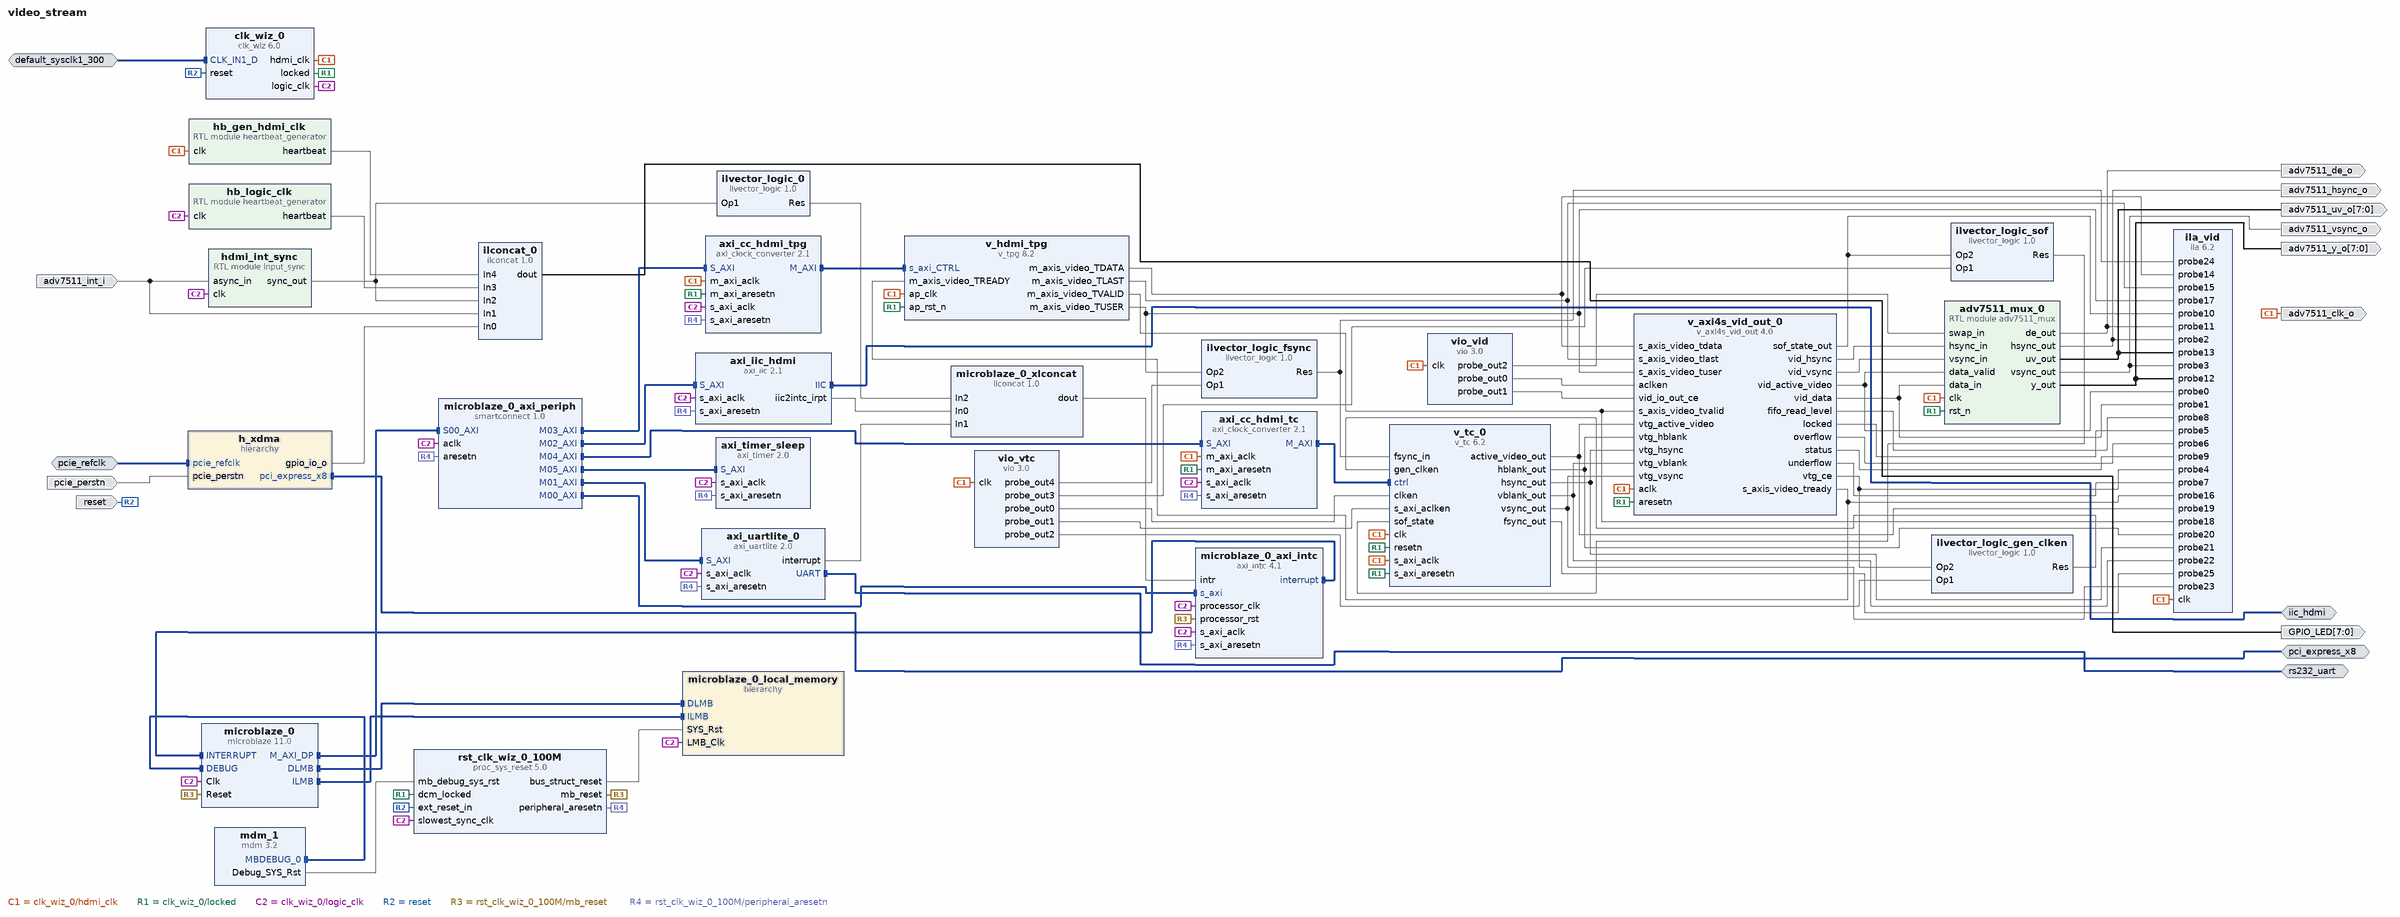
[diagram p0: block diagram of the top level]
# Vivado block design video_stream, xcku5p-ffvb676-2-e, Vivado 2025.2
create_bd_design video_stream

create_bd_intf_port -mode Slave -vlnv xilinx.com:interface:diff_clock_rtl:1.0 pcie_refclk
set_property -dict {CONFIG.FREQ_HZ 100000000} [get_bd_intf_ports pcie_refclk]
create_bd_intf_port -mode Master -vlnv xilinx.com:interface:pcie_7x_mgt_rtl:1.0 pci_express_x8
create_bd_intf_port -mode Slave -vlnv xilinx.com:interface:diff_clock_rtl:1.0 default_sysclk1_300
set_property -dict {CONFIG.FREQ_HZ 300000000} [get_bd_intf_ports default_sysclk1_300]
create_bd_intf_port -mode Master -vlnv xilinx.com:interface:iic_rtl:1.0 iic_hdmi
create_bd_intf_port -mode Master -vlnv xilinx.com:interface:uart_rtl:1.0 rs232_uart
create_bd_port -dir I -type rst pcie_perstn
set_property -dict {CONFIG.POLARITY ACTIVE_LOW} [get_bd_ports pcie_perstn]
create_bd_port -dir I -type rst reset
set_property -dict {CONFIG.POLARITY ACTIVE_HIGH} [get_bd_ports reset]
create_bd_port -dir O -from 7 -to 0 adv7511_y_o
create_bd_port -dir O -from 7 -to 0 adv7511_uv_o
create_bd_port -dir O adv7511_de_o
create_bd_port -dir O adv7511_hsync_o
create_bd_port -dir O adv7511_vsync_o
create_bd_port -dir O adv7511_clk_o
create_bd_port -dir O -from 7 -to 0 GPIO_LED
create_bd_port -dir I adv7511_int_i

create_bd_cell -type ip -vlnv xilinx.com:ip:v_tpg:8.2 v_hdmi_tpg
set_property -dict [list \
  CONFIG.COLOR_SWEEP 1 \
  CONFIG.DISPLAY_PORT 0 \
  CONFIG.HAS_AXI4S_SLAVE 0 \
  CONFIG.HAS_AXI4_YUV422_YUV420 1 \
  CONFIG.MAX_COLS 1920 \
  CONFIG.MAX_ROWS 1080 \
  CONFIG.RAMP 1 \
  CONFIG.ZONE_PLATE 1 \
] [get_bd_cells v_hdmi_tpg]
create_bd_cell -type ip -vlnv xilinx.com:ip:clk_wiz:6.0 clk_wiz_0
set_property -dict [list \
  CONFIG.CLKIN1_JITTER_PS 33.330000000000005 \
  CONFIG.CLKOUT1_JITTER 115.350 \
  CONFIG.CLKOUT1_PHASE_ERROR 87.466 \
  CONFIG.CLKOUT1_REQUESTED_OUT_FREQ 100 \
  CONFIG.CLKOUT2_JITTER 107.131 \
  CONFIG.CLKOUT2_PHASE_ERROR 87.466 \
  CONFIG.CLKOUT2_REQUESTED_OUT_FREQ 148.4375 \
  CONFIG.CLKOUT2_USED true \
  CONFIG.CLK_IN1_BOARD_INTERFACE default_sysclk1_300 \
  CONFIG.CLK_OUT1_PORT logic_clk \
  CONFIG.CLK_OUT2_PORT hdmi_clk \
  CONFIG.MMCM_CLKFBOUT_MULT_F 11.875 \
  CONFIG.MMCM_CLKIN1_PERIOD 3.333 \
  CONFIG.MMCM_CLKIN2_PERIOD 10.0 \
  CONFIG.MMCM_CLKOUT0_DIVIDE_F 11.875 \
  CONFIG.MMCM_CLKOUT1_DIVIDE 8 \
  CONFIG.MMCM_DIVCLK_DIVIDE 3 \
  CONFIG.NUM_OUT_CLKS 2 \
  CONFIG.PRIM_SOURCE Differential_clock_capable_pin \
  CONFIG.RESET_BOARD_INTERFACE reset \
  CONFIG.RESET_PORT reset \
  CONFIG.RESET_TYPE ACTIVE_HIGH \
  CONFIG.USE_BOARD_FLOW true \
] [get_bd_cells clk_wiz_0]
create_bd_cell -type ip -vlnv xilinx.com:ip:axi_iic:2.1 axi_iic_hdmi
set_property -dict {CONFIG.IIC_BOARD_INTERFACE Custom CONFIG.USE_BOARD_FLOW true} [get_bd_cells axi_iic_hdmi]
create_bd_cell -type ip -vlnv xilinx.com:ip:microblaze:11.0 microblaze_0
set_property -dict [list \
  CONFIG.C_DEBUG_ENABLED 1 \
  CONFIG.C_D_AXI 1 \
  CONFIG.C_D_LMB 1 \
  CONFIG.C_ENABLE_CONVERSION 0 \
  CONFIG.C_I_LMB 1 \
] [get_bd_cells microblaze_0]
create_bd_cell -type hier microblaze_0_local_memory
create_bd_cell -type ip -vlnv xilinx.com:ip:smartconnect:1.0 microblaze_0_axi_periph
set_property -dict {CONFIG.NUM_MI 6 CONFIG.NUM_SI 1} [get_bd_cells microblaze_0_axi_periph]
create_bd_cell -type ip -vlnv xilinx.com:ip:axi_intc:4.1 microblaze_0_axi_intc
set_property -dict [list \
  CONFIG.C_HAS_FAST 1 \
  CONFIG.C_KIND_OF_EDGE 0xFFFFFFFF \
  CONFIG.C_KIND_OF_INTR 0xFFFFFFF8 \
  CONFIG.C_KIND_OF_LVL 0xFFFFFFFF \
] [get_bd_cells microblaze_0_axi_intc]
create_bd_cell -type inline_hdl -vlnv xilinx.com:inline_hdl:ilconcat:1.0 microblaze_0_xlconcat
set_property -dict {CONFIG.NUM_PORTS 3} [get_bd_cells microblaze_0_xlconcat]
create_bd_cell -type ip -vlnv xilinx.com:ip:mdm:3.2 mdm_1
create_bd_cell -type ip -vlnv xilinx.com:ip:proc_sys_reset:5.0 rst_clk_wiz_0_100M
set_property -dict {CONFIG.RESET_BOARD_INTERFACE reset CONFIG.USE_BOARD_FLOW true} [get_bd_cells rst_clk_wiz_0_100M]
create_bd_cell -type ip -vlnv xilinx.com:ip:axi_uartlite:2.0 axi_uartlite_0
set_property -dict {CONFIG.UARTLITE_BOARD_INTERFACE rs232_uart CONFIG.USE_BOARD_FLOW true} [get_bd_cells axi_uartlite_0]
create_bd_cell -type hier h_xdma
create_bd_cell -type ip -vlnv xilinx.com:ip:v_tc:6.2 v_tc_0
set_property -dict [list \
  CONFIG.INTERLACE_EN false \
  CONFIG.SYNC_EN true \
  CONFIG.VIDEO_MODE 1080p \
  CONFIG.enable_detection false \
  CONFIG.enable_generation true \
] [get_bd_cells v_tc_0]
create_bd_cell -type ip -vlnv xilinx.com:ip:axi_clock_converter:2.1 axi_cc_hdmi_tc
create_bd_cell -type ip -vlnv xilinx.com:ip:v_axi4s_vid_out:4.0 v_axi4s_vid_out_0
set_property -dict {CONFIG.C_ADDR_WIDTH 11 CONFIG.C_S_AXIS_VIDEO_FORMAT 2} [get_bd_cells v_axi4s_vid_out_0]
create_bd_cell -type ip -vlnv xilinx.com:ip:axi_clock_converter:2.1 axi_cc_hdmi_tpg
create_bd_cell -type module -reference adv7511_mux adv7511_mux_0
create_bd_cell -type inline_hdl -vlnv xilinx.com:inline_hdl:ilvector_logic:1.0 ilvector_logic_0
set_property -dict {CONFIG.C_OPERATION not CONFIG.C_SIZE 1} [get_bd_cells ilvector_logic_0]
create_bd_cell -type module -reference input_sync hdmi_int_sync
create_bd_cell -type inline_hdl -vlnv xilinx.com:inline_hdl:ilconcat:1.0 ilconcat_0
set_property -dict {CONFIG.NUM_PORTS 5} [get_bd_cells ilconcat_0]
create_bd_cell -type module -reference heartbeat_generator hb_logic_clk
create_bd_cell -type module -reference heartbeat_generator hb_gen_hdmi_clk
create_bd_cell -type ip -vlnv xilinx.com:ip:axi_timer:2.0 axi_timer_sleep
create_bd_cell -type ip -vlnv xilinx.com:ip:vio:3.0 vio_vtc
set_property -dict [list \
  CONFIG.C_NUM_PROBE_IN 0 \
  CONFIG.C_NUM_PROBE_OUT 5 \
  CONFIG.C_PROBE_OUT0_INIT_VAL 0x1 \
  CONFIG.C_PROBE_OUT1_INIT_VAL 0x1 \
  CONFIG.C_PROBE_OUT2_INIT_VAL 0x1 \
  CONFIG.C_PROBE_OUT3_INIT_VAL 0x1 \
  CONFIG.C_PROBE_OUT4_INIT_VAL 0x0 \
] [get_bd_cells vio_vtc]
create_bd_cell -type ip -vlnv xilinx.com:ip:ila:6.2 ila_vid
set_property -dict {CONFIG.C_DATA_DEPTH 4096 CONFIG.C_MONITOR_TYPE Native CONFIG.C_NUM_OF_PROBES 26} [get_bd_cells ila_vid]
create_bd_cell -type ip -vlnv xilinx.com:ip:vio:3.0 vio_vid
set_property -dict [list \
  CONFIG.C_NUM_PROBE_IN 0 \
  CONFIG.C_NUM_PROBE_OUT 3 \
  CONFIG.C_PROBE_OUT0_INIT_VAL 0x1 \
  CONFIG.C_PROBE_OUT1_INIT_VAL 0x1 \
] [get_bd_cells vio_vid]
create_bd_cell -type inline_hdl -vlnv xilinx.com:inline_hdl:ilvector_logic:1.0 ilvector_logic_gen_clken
set_property -dict {CONFIG.C_SIZE 1} [get_bd_cells ilvector_logic_gen_clken]
create_bd_cell -type inline_hdl -vlnv xilinx.com:inline_hdl:ilvector_logic:1.0 ilvector_logic_sof
set_property -dict {CONFIG.C_SIZE 1} [get_bd_cells ilvector_logic_sof]
create_bd_cell -type inline_hdl -vlnv xilinx.com:inline_hdl:ilvector_logic:1.0 ilvector_logic_fsync
set_property -dict {CONFIG.C_SIZE 1} [get_bd_cells ilvector_logic_fsync]

# ---- hierarchy /microblaze_0_local_memory ----
current_bd_instance /microblaze_0_local_memory
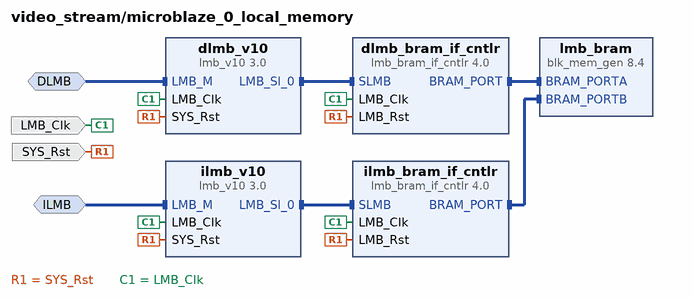
[diagram p1: block diagram inside /microblaze_0_local_memory]
create_bd_intf_pin -mode MirroredMaster -vlnv xilinx.com:interface:lmb_rtl:1.0 DLMB
create_bd_intf_pin -mode MirroredMaster -vlnv xilinx.com:interface:lmb_rtl:1.0 ILMB
create_bd_pin -dir I -type clk LMB_Clk
create_bd_pin -dir I -type rst SYS_Rst

create_bd_cell -type ip -vlnv xilinx.com:ip:lmb_v10:3.0 dlmb_v10
create_bd_cell -type ip -vlnv xilinx.com:ip:lmb_v10:3.0 ilmb_v10
create_bd_cell -type ip -vlnv xilinx.com:ip:lmb_bram_if_cntlr:4.0 dlmb_bram_if_cntlr
set_property -dict {CONFIG.C_ECC 0} [get_bd_cells dlmb_bram_if_cntlr]
create_bd_cell -type ip -vlnv xilinx.com:ip:lmb_bram_if_cntlr:4.0 ilmb_bram_if_cntlr
set_property -dict {CONFIG.C_ECC 0} [get_bd_cells ilmb_bram_if_cntlr]
create_bd_cell -type ip -vlnv xilinx.com:ip:blk_mem_gen:8.4 lmb_bram
set_property -dict {CONFIG.Memory_Type True_Dual_Port_RAM CONFIG.use_bram_block BRAM_Controller} [get_bd_cells lmb_bram]

# ---- hierarchy /h_xdma ----
current_bd_instance /h_xdma
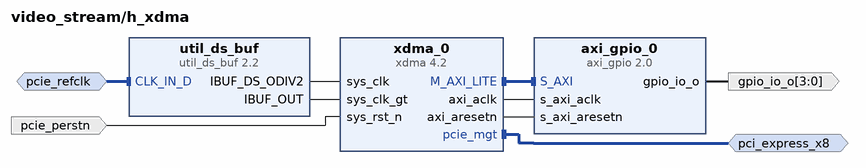
[diagram p2: block diagram inside /h_xdma]
create_bd_intf_pin -mode Master -vlnv xilinx.com:interface:pcie_7x_mgt_rtl:1.0 pci_express_x8
create_bd_intf_pin -mode Slave -vlnv xilinx.com:interface:diff_clock_rtl:1.0 pcie_refclk
create_bd_pin -dir I -type rst pcie_perstn
create_bd_pin -dir O -from 3 -to 0 gpio_io_o

create_bd_cell -type ip -vlnv xilinx.com:ip:xdma:4.2 xdma_0
set_property -dict [list \
  CONFIG.PCIE_BOARD_INTERFACE pci_express_x8 \
  CONFIG.SYS_RST_N_BOARD_INTERFACE pcie_perstn \
  CONFIG.axi_data_width 256_bit \
  CONFIG.axilite_master_en true \
  CONFIG.axilite_master_size 1 \
  CONFIG.axisten_freq 250 \
  CONFIG.pl_link_cap_max_link_speed 8.0_GT/s \
  CONFIG.xdma_axi_intf_mm AXI_Stream \
  CONFIG.xdma_axilite_slave false \
  CONFIG.xdma_rnum_chnl 1 \
] [get_bd_cells xdma_0]
create_bd_cell -type ip -vlnv xilinx.com:ip:util_ds_buf:2.2 util_ds_buf
set_property -dict {CONFIG.DIFF_CLK_IN_BOARD_INTERFACE pcie_refclk CONFIG.USE_BOARD_FLOW true} [get_bd_cells util_ds_buf]
create_bd_cell -type ip -vlnv xilinx.com:ip:axi_gpio:2.0 axi_gpio_0
set_property -dict {CONFIG.C_GPIO_WIDTH 4 CONFIG.GPIO_BOARD_INTERFACE Custom CONFIG.USE_BOARD_FLOW true} [get_bd_cells axi_gpio_0]

# ---- connections ----

current_bd_instance /microblaze_0_local_memory
connect_bd_intf_net -intf_net microblaze_0_dlmb [get_bd_intf_pins dlmb_v10/LMB_M] [get_bd_intf_pins DLMB]
connect_bd_intf_net -intf_net microblaze_0_dlmb_bus [get_bd_intf_pins dlmb_v10/LMB_Sl_0] [get_bd_intf_pins dlmb_bram_if_cntlr/SLMB]
connect_bd_intf_net -intf_net microblaze_0_dlmb_cntlr [get_bd_intf_pins dlmb_bram_if_cntlr/BRAM_PORT] [get_bd_intf_pins lmb_bram/BRAM_PORTA]
connect_bd_intf_net -intf_net microblaze_0_ilmb [get_bd_intf_pins ilmb_v10/LMB_M] [get_bd_intf_pins ILMB]
connect_bd_intf_net -intf_net microblaze_0_ilmb_bus [get_bd_intf_pins ilmb_v10/LMB_Sl_0] [get_bd_intf_pins ilmb_bram_if_cntlr/SLMB]
connect_bd_intf_net -intf_net microblaze_0_ilmb_cntlr [get_bd_intf_pins ilmb_bram_if_cntlr/BRAM_PORT] [get_bd_intf_pins lmb_bram/BRAM_PORTB]
connect_bd_net [get_bd_pins SYS_Rst] \
  [get_bd_pins dlmb_v10/SYS_Rst] [get_bd_pins dlmb_bram_if_cntlr/LMB_Rst] [get_bd_pins ilmb_v10/SYS_Rst] \
  [get_bd_pins ilmb_bram_if_cntlr/LMB_Rst]
connect_bd_net -net clk_wiz_0_logic_clk [get_bd_pins LMB_Clk] \
  [get_bd_pins dlmb_v10/LMB_Clk] [get_bd_pins dlmb_bram_if_cntlr/LMB_Clk] [get_bd_pins ilmb_v10/LMB_Clk] \
  [get_bd_pins ilmb_bram_if_cntlr/LMB_Clk]
set_property HDL_ATTRIBUTE.BMM_INFO_ADDRESS_SPACE {byte  0x00000000 32 > video_stream microblaze_0_local_memory/lmb_bram} [get_bd_cells dlmb_bram_if_cntlr]
set_property HDL_ATTRIBUTE.KEEP_HIERARCHY yes [get_bd_cells dlmb_bram_if_cntlr]

current_bd_instance /h_xdma
connect_bd_intf_net [get_bd_intf_pins pcie_refclk] [get_bd_intf_pins util_ds_buf/CLK_IN_D]
connect_bd_intf_net [get_bd_intf_pins axi_gpio_0/S_AXI] [get_bd_intf_pins xdma_0/M_AXI_LITE]
connect_bd_intf_net [get_bd_intf_pins pci_express_x8] [get_bd_intf_pins xdma_0/pcie_mgt]
connect_bd_net [get_bd_pins axi_gpio_0/gpio_io_o] [get_bd_pins gpio_io_o]
connect_bd_net [get_bd_pins pcie_perstn] [get_bd_pins xdma_0/sys_rst_n]
connect_bd_net [get_bd_pins util_ds_buf/IBUF_DS_ODIV2] [get_bd_pins xdma_0/sys_clk]
connect_bd_net [get_bd_pins util_ds_buf/IBUF_OUT] [get_bd_pins xdma_0/sys_clk_gt]
connect_bd_net [get_bd_pins xdma_0/axi_aclk] [get_bd_pins axi_gpio_0/s_axi_aclk]
connect_bd_net [get_bd_pins xdma_0/axi_aresetn] [get_bd_pins axi_gpio_0/s_axi_aresetn]

current_bd_instance /
connect_bd_intf_net -intf_net axi_clock_converter_0_M_AXI [get_bd_intf_pins axi_cc_hdmi_tc/M_AXI] [get_bd_intf_pins v_tc_0/ctrl]
connect_bd_intf_net -intf_net axi_clock_converter_1_M_AXI [get_bd_intf_pins axi_cc_hdmi_tpg/M_AXI] [get_bd_intf_pins v_hdmi_tpg/s_axi_CTRL]
connect_bd_intf_net -intf_net axi_iic_0_IIC [get_bd_intf_ports iic_hdmi] [get_bd_intf_pins axi_iic_hdmi/IIC]
connect_bd_intf_net [get_bd_intf_ports rs232_uart] [get_bd_intf_pins axi_uartlite_0/UART]
connect_bd_intf_net -intf_net default_sysclk1_300_1 [get_bd_intf_ports default_sysclk1_300] [get_bd_intf_pins clk_wiz_0/CLK_IN1_D]
connect_bd_intf_net -intf_net microblaze_0_axi_dp [get_bd_intf_pins microblaze_0_axi_periph/S00_AXI] [get_bd_intf_pins microblaze_0/M_AXI_DP]
connect_bd_intf_net [get_bd_intf_pins microblaze_0_axi_periph/M00_AXI] [get_bd_intf_pins microblaze_0_axi_intc/s_axi]
connect_bd_intf_net [get_bd_intf_pins axi_uartlite_0/S_AXI] [get_bd_intf_pins microblaze_0_axi_periph/M01_AXI]
connect_bd_intf_net [get_bd_intf_pins axi_iic_hdmi/S_AXI] [get_bd_intf_pins microblaze_0_axi_periph/M02_AXI]
connect_bd_intf_net [get_bd_intf_pins microblaze_0_axi_periph/M03_AXI] [get_bd_intf_pins axi_cc_hdmi_tpg/S_AXI]
connect_bd_intf_net [get_bd_intf_pins axi_cc_hdmi_tc/S_AXI] [get_bd_intf_pins microblaze_0_axi_periph/M04_AXI]
connect_bd_intf_net [get_bd_intf_pins microblaze_0_axi_periph/M05_AXI] [get_bd_intf_pins axi_timer_sleep/S_AXI]
connect_bd_intf_net [get_bd_intf_pins mdm_1/MBDEBUG_0] [get_bd_intf_pins microblaze_0/DEBUG]
connect_bd_intf_net [get_bd_intf_pins microblaze_0/DLMB] [get_bd_intf_pins microblaze_0_local_memory/DLMB]
connect_bd_intf_net [get_bd_intf_pins microblaze_0/ILMB] [get_bd_intf_pins microblaze_0_local_memory/ILMB]
connect_bd_intf_net [get_bd_intf_pins microblaze_0_axi_intc/interrupt] [get_bd_intf_pins microblaze_0/INTERRUPT]
connect_bd_intf_net [get_bd_intf_ports pcie_refclk] [get_bd_intf_pins h_xdma/pcie_refclk]
connect_bd_intf_net -intf_net xdma_0_pcie_mgt [get_bd_intf_ports pci_express_x8] [get_bd_intf_pins h_xdma/pci_express_x8]
connect_bd_net [get_bd_ports adv7511_int_i] [get_bd_pins hdmi_int_sync/async_in] [get_bd_pins ilconcat_0/In1]
connect_bd_net [get_bd_pins adv7511_mux_0/de_out] [get_bd_ports adv7511_de_o] [get_bd_pins ila_vid/probe11]
connect_bd_net [get_bd_pins adv7511_mux_0/hsync_out] [get_bd_ports adv7511_hsync_o] [get_bd_pins ila_vid/probe2]
connect_bd_net [get_bd_pins adv7511_mux_0/uv_out] [get_bd_ports adv7511_uv_o] [get_bd_pins ila_vid/probe13]
connect_bd_net [get_bd_pins adv7511_mux_0/vsync_out] [get_bd_ports adv7511_vsync_o] [get_bd_pins ila_vid/probe3]
connect_bd_net [get_bd_pins adv7511_mux_0/y_out] [get_bd_ports adv7511_y_o] [get_bd_pins ila_vid/probe12]
connect_bd_net -net axi_iic_0_iic2intc_irpt [get_bd_pins axi_iic_hdmi/iic2intc_irpt] [get_bd_pins microblaze_0_xlconcat/In0]
connect_bd_net [get_bd_pins axi_uartlite_0/interrupt] [get_bd_pins microblaze_0_xlconcat/In1]
connect_bd_net -net clk_wiz_0_clk_out1 [get_bd_pins clk_wiz_0/hdmi_clk] \
  [get_bd_pins axi_cc_hdmi_tc/m_axi_aclk] [get_bd_pins v_tc_0/clk] [get_bd_pins axi_cc_hdmi_tpg/m_axi_aclk] \
  [get_bd_pins v_hdmi_tpg/ap_clk] [get_bd_pins v_axi4s_vid_out_0/aclk] [get_bd_pins v_tc_0/s_axi_aclk] \
  [get_bd_ports adv7511_clk_o] [get_bd_pins hb_gen_hdmi_clk/clk] [get_bd_pins vio_vtc/clk] [get_bd_pins ila_vid/clk] \
  [get_bd_pins vio_vid/clk] [get_bd_pins adv7511_mux_0/clk]
connect_bd_net [get_bd_pins clk_wiz_0/locked] \
  [get_bd_pins rst_clk_wiz_0_100M/dcm_locked] [get_bd_pins axi_cc_hdmi_tc/m_axi_aresetn] [get_bd_pins v_tc_0/s_axi_aresetn] \
  [get_bd_pins axi_cc_hdmi_tpg/m_axi_aresetn] [get_bd_pins v_hdmi_tpg/ap_rst_n] [get_bd_pins v_axi4s_vid_out_0/aresetn] \
  [get_bd_pins v_tc_0/resetn] [get_bd_pins adv7511_mux_0/rst_n]
connect_bd_net [get_bd_pins clk_wiz_0/logic_clk] \
  [get_bd_pins microblaze_0/Clk] [get_bd_pins microblaze_0_axi_periph/aclk] [get_bd_pins microblaze_0_axi_intc/s_axi_aclk] \
  [get_bd_pins microblaze_0_axi_intc/processor_clk] [get_bd_pins microblaze_0_local_memory/LMB_Clk] \
  [get_bd_pins rst_clk_wiz_0_100M/slowest_sync_clk] [get_bd_pins axi_uartlite_0/s_axi_aclk] \
  [get_bd_pins axi_iic_hdmi/s_axi_aclk] [get_bd_pins axi_cc_hdmi_tc/s_axi_aclk] [get_bd_pins axi_cc_hdmi_tpg/s_axi_aclk] \
  [get_bd_pins hdmi_int_sync/clk] [get_bd_pins hb_logic_clk/clk] [get_bd_pins axi_timer_sleep/s_axi_aclk]
connect_bd_net [get_bd_pins h_xdma/gpio_io_o] [get_bd_pins ilconcat_0/In0]
connect_bd_net [get_bd_pins hb_gen_hdmi_clk/heartbeat] [get_bd_pins ilconcat_0/In4]
connect_bd_net [get_bd_pins hb_logic_clk/heartbeat] [get_bd_pins ilconcat_0/In3]
connect_bd_net [get_bd_pins ilconcat_0/dout] [get_bd_ports GPIO_LED]
connect_bd_net [get_bd_pins ilvector_logic_0/Res] [get_bd_pins microblaze_0_xlconcat/In2]
connect_bd_net [get_bd_pins ilvector_logic_fsync/Res] [get_bd_pins v_tc_0/fsync_in] [get_bd_pins ila_vid/probe24]
connect_bd_net [get_bd_pins ilvector_logic_gen_clken/Res] [get_bd_pins v_tc_0/gen_clken]
connect_bd_net [get_bd_pins ilvector_logic_sof/Res] [get_bd_pins v_tc_0/sof_state]
connect_bd_net -net input_sync_0_sync_out [get_bd_pins hdmi_int_sync/sync_out] [get_bd_pins ilvector_logic_0/Op1] [get_bd_pins ilconcat_0/In2]
connect_bd_net [get_bd_pins mdm_1/Debug_SYS_Rst] [get_bd_pins rst_clk_wiz_0_100M/mb_debug_sys_rst]
connect_bd_net -net microblaze_0_intr [get_bd_pins microblaze_0_xlconcat/dout] [get_bd_pins microblaze_0_axi_intc/intr]
connect_bd_net [get_bd_ports pcie_perstn] [get_bd_pins h_xdma/pcie_perstn]
connect_bd_net [get_bd_ports reset] [get_bd_pins rst_clk_wiz_0_100M/ext_reset_in] [get_bd_pins clk_wiz_0/reset]
connect_bd_net [get_bd_pins rst_clk_wiz_0_100M/bus_struct_reset] [get_bd_pins microblaze_0_local_memory/SYS_Rst]
connect_bd_net [get_bd_pins rst_clk_wiz_0_100M/mb_reset] [get_bd_pins microblaze_0/Reset] [get_bd_pins microblaze_0_axi_intc/processor_rst]
connect_bd_net [get_bd_pins rst_clk_wiz_0_100M/peripheral_aresetn] \
  [get_bd_pins microblaze_0_axi_periph/aresetn] [get_bd_pins microblaze_0_axi_intc/s_axi_aresetn] \
  [get_bd_pins axi_uartlite_0/s_axi_aresetn] [get_bd_pins axi_iic_hdmi/s_axi_aresetn] \
  [get_bd_pins axi_cc_hdmi_tc/s_axi_aresetn] [get_bd_pins axi_cc_hdmi_tpg/s_axi_aresetn] \
  [get_bd_pins axi_timer_sleep/s_axi_aresetn]
connect_bd_net [get_bd_pins v_axi4s_vid_out_0/fifo_read_level] [get_bd_pins ila_vid/probe8]
connect_bd_net [get_bd_pins v_axi4s_vid_out_0/locked] [get_bd_pins ila_vid/probe5]
connect_bd_net [get_bd_pins v_axi4s_vid_out_0/overflow] [get_bd_pins ila_vid/probe6]
connect_bd_net [get_bd_pins v_axi4s_vid_out_0/s_axis_video_tready] [get_bd_pins v_hdmi_tpg/m_axis_video_TREADY] [get_bd_pins ila_vid/probe16]
connect_bd_net [get_bd_pins v_axi4s_vid_out_0/sof_state_out] [get_bd_pins ila_vid/probe10] [get_bd_pins ilvector_logic_sof/Op2]
connect_bd_net [get_bd_pins v_axi4s_vid_out_0/status] [get_bd_pins ila_vid/probe9]
connect_bd_net [get_bd_pins v_axi4s_vid_out_0/underflow] [get_bd_pins ila_vid/probe7]
connect_bd_net [get_bd_pins v_axi4s_vid_out_0/vid_active_video] [get_bd_pins ila_vid/probe0] [get_bd_pins adv7511_mux_0/data_valid]
connect_bd_net [get_bd_pins v_axi4s_vid_out_0/vid_data] [get_bd_pins ila_vid/probe1] [get_bd_pins adv7511_mux_0/data_in]
connect_bd_net [get_bd_pins v_axi4s_vid_out_0/vid_hsync] [get_bd_pins adv7511_mux_0/hsync_in]
connect_bd_net [get_bd_pins v_axi4s_vid_out_0/vid_vsync] [get_bd_pins adv7511_mux_0/vsync_in]
connect_bd_net [get_bd_pins v_axi4s_vid_out_0/vtg_ce] [get_bd_pins ila_vid/probe4] [get_bd_pins ilvector_logic_gen_clken/Op2]
connect_bd_net [get_bd_pins v_hdmi_tpg/m_axis_video_TDATA] [get_bd_pins v_axi4s_vid_out_0/s_axis_video_tdata] [get_bd_pins ila_vid/probe14]
connect_bd_net [get_bd_pins v_hdmi_tpg/m_axis_video_TLAST] [get_bd_pins v_axi4s_vid_out_0/s_axis_video_tlast] [get_bd_pins ila_vid/probe15]
connect_bd_net [get_bd_pins v_hdmi_tpg/m_axis_video_TUSER] \
  [get_bd_pins v_axi4s_vid_out_0/s_axis_video_tuser] [get_bd_pins ila_vid/probe17] [get_bd_pins ilvector_logic_fsync/Op2]
connect_bd_net [get_bd_pins v_hdmi_tpg/m_axis_video_TVALID] [get_bd_pins v_axi4s_vid_out_0/s_axis_video_tvalid] [get_bd_pins ila_vid/probe18]
connect_bd_net [get_bd_pins v_tc_0/active_video_out] [get_bd_pins v_axi4s_vid_out_0/vtg_active_video] [get_bd_pins ila_vid/probe19]
connect_bd_net [get_bd_pins v_tc_0/fsync_out] [get_bd_pins ila_vid/probe25]
connect_bd_net [get_bd_pins v_tc_0/hblank_out] [get_bd_pins v_axi4s_vid_out_0/vtg_hblank] [get_bd_pins ila_vid/probe20]
connect_bd_net [get_bd_pins v_tc_0/hsync_out] [get_bd_pins v_axi4s_vid_out_0/vtg_hsync] [get_bd_pins ila_vid/probe21]
connect_bd_net [get_bd_pins v_tc_0/vblank_out] [get_bd_pins v_axi4s_vid_out_0/vtg_vblank] [get_bd_pins ila_vid/probe22]
connect_bd_net [get_bd_pins v_tc_0/vsync_out] [get_bd_pins v_axi4s_vid_out_0/vtg_vsync] [get_bd_pins ila_vid/probe23]
connect_bd_net -net vio_0_probe_out0 [get_bd_pins vio_vtc/probe_out0] [get_bd_pins v_tc_0/clken]
connect_bd_net -net vio_0_probe_out1 [get_bd_pins vio_vtc/probe_out1] [get_bd_pins v_tc_0/s_axi_aclken]
connect_bd_net [get_bd_pins vio_vid/probe_out0] [get_bd_pins v_axi4s_vid_out_0/aclken]
connect_bd_net [get_bd_pins vio_vid/probe_out1] [get_bd_pins v_axi4s_vid_out_0/vid_io_out_ce]
connect_bd_net [get_bd_pins vio_vid/probe_out2] [get_bd_pins adv7511_mux_0/swap_in]
connect_bd_net [get_bd_pins vio_vtc/probe_out2] [get_bd_pins ilvector_logic_gen_clken/Op1]
connect_bd_net [get_bd_pins vio_vtc/probe_out3] [get_bd_pins ilvector_logic_sof/Op1]
connect_bd_net [get_bd_pins vio_vtc/probe_out4] [get_bd_pins ilvector_logic_fsync/Op1]
set_property HDL_ATTRIBUTE.BMM_INFO_PROCESSOR {microblaze-le > video_stream microblaze_0_local_memory/dlmb_bram_if_cntlr} [get_bd_cells microblaze_0]
set_property HDL_ATTRIBUTE.KEEP_HIERARCHY yes [get_bd_cells microblaze_0]

# ---- address map ----
assign_bd_address -offset 0x00000000 -range 64K -target_address_space [get_bd_addr_spaces h_xdma/xdma_0/M_AXI_LITE] [get_bd_addr_segs h_xdma/axi_gpio_0/S_AXI/Reg]
assign_bd_address -offset 0x00000000 -range 64K -target_address_space [get_bd_addr_spaces microblaze_0/Data] [get_bd_addr_segs microblaze_0_local_memory/dlmb_bram_if_cntlr/SLMB/Mem]
assign_bd_address -offset 0x40000000 -range 64K -target_address_space [get_bd_addr_spaces microblaze_0/Data] [get_bd_addr_segs axi_timer_sleep/S_AXI/Reg]
assign_bd_address -offset 0x40010000 -range 64K -target_address_space [get_bd_addr_spaces microblaze_0/Data] [get_bd_addr_segs microblaze_0_axi_intc/S_AXI/Reg]
assign_bd_address -offset 0x40020000 -range 64K -target_address_space [get_bd_addr_spaces microblaze_0/Data] [get_bd_addr_segs axi_iic_hdmi/S_AXI/Reg]
assign_bd_address -offset 0x40030000 -range 64K -target_address_space [get_bd_addr_spaces microblaze_0/Data] [get_bd_addr_segs axi_uartlite_0/S_AXI/Reg]
assign_bd_address -offset 0x40040000 -range 64K -target_address_space [get_bd_addr_spaces microblaze_0/Data] [get_bd_addr_segs v_hdmi_tpg/s_axi_CTRL/Reg]
assign_bd_address -offset 0x40050000 -range 64K -target_address_space [get_bd_addr_spaces microblaze_0/Data] [get_bd_addr_segs v_tc_0/ctrl/Reg]
assign_bd_address -offset 0x00000000 -range 64K -target_address_space [get_bd_addr_spaces microblaze_0/Instruction] [get_bd_addr_segs microblaze_0_local_memory/ilmb_bram_if_cntlr/SLMB/Mem]

validate_bd_design
save_bd_design
